# Altium schematic sheet main.SchDoc
size A4; DocumentNumber: 1; SheetNumber: 1; SheetTotal: 1; PageSetup: Record=PageOptions|CenterHorizontal=True|CenterVertical=True|PrintScale=0.98|XCorrection=1.00|YCorrection=1.00|PrintKind=0|BorderSize=5000000|LeftOffset=0|BottomOffset=0|Orientation=2|PaperLength=1000|PaperWidth=1000|Scale=100|PaperSource=7|PrintQuality=-4|MediaType=1|DitherType=10|PaperKind=A4|PrintScaleMode=1
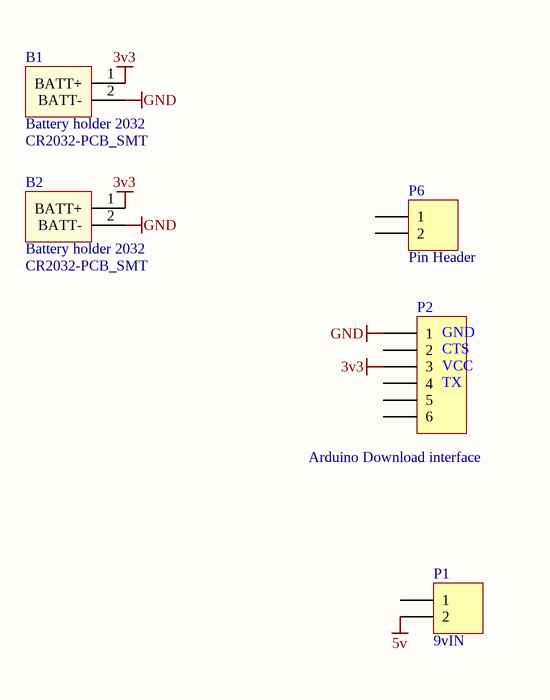
[diagram p0: main.SchDoc]

## Parts
B1  Battery holder 2032  Part Number: CR2032-PCB_SMT  [CR2032_pcb_SMT]
B2  Battery holder 2032  Part Number: CR2032-PCB_SMT  [CR2032_pcb_SMT]
P1  9vIN  [PH1x2_2.54]
P2  Arduino Download interface  [PH1x6_2.54]
P6  Pin Header  [PH1x2_2.54]

## Nets
3v3: B1.1(BATT+) B2.1(BATT+) P2.3
5v: P1.2
GND: B1.2(BATT-) B2.2(BATT-) P2.1

Not connected (* = marked no-connect by the designer): P1 1; P2 2 4 5 6; P6 1 2

## Notes on the sheet
- (near P2) GND
- (near P2) CTS
- (near P2) VCC
- (near P2) TX
- Title
- Size:
- Date:
- A4
- Number:
- Time:
- Revision:
- Sheet
- of
- File:

## Library data of the parts
B1 B2 = CR2032-PCB_SMT: BATTERY; Supplier 1: Farnell; Supplier Part Number 1: 2064713
P1 = PH1x2: Con1x2; Part Number: PH1x2
P2 = PH1x6: Con1x6; Part Number: PH1x6; ClassName: ArduinoDownload
P6 = PH1x2: Con1x2; Part Number: PH1x2; Pitch: 2.54; LatestRevision Note: Initial Release; Type: Pin Header; Number Of Pins: 2; Component Type: Standard; LatestRevision Date: 23/11/2010; Author: Willy Pietersz; Supplier 1: Farnell